# EAGLE design WS2811_Relais (EAGLE 9.5.2)
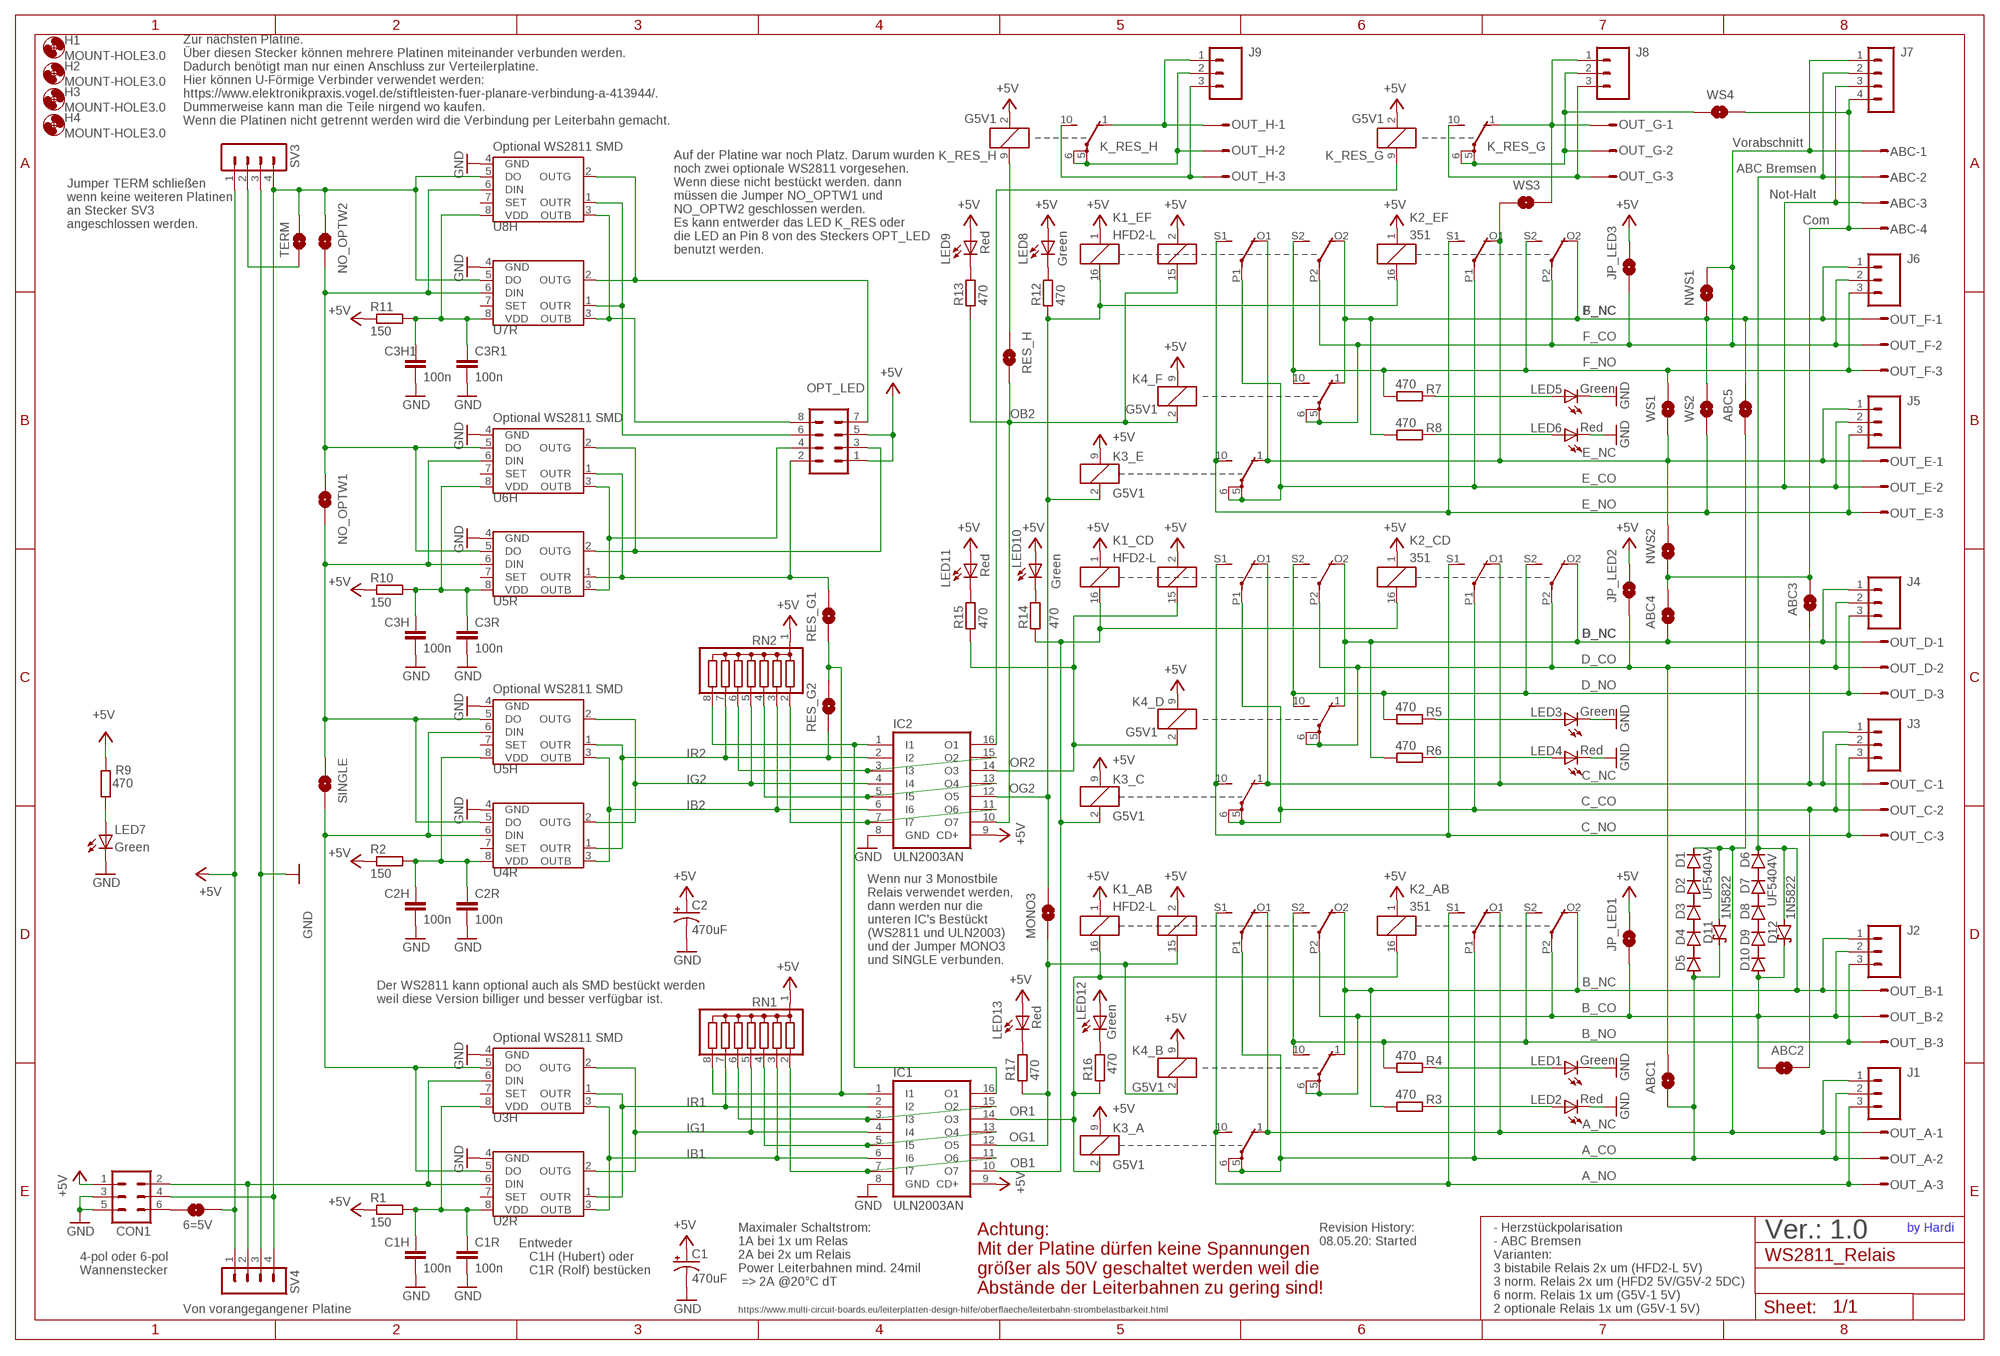
[diagram p0: schematic, sheet 1]

## Parts
6=5V  SOLDERJUMPERNO  [SJ_2S-NO]
ABC  STL1550-4ON_BOARD  [STL1550-4_ON_BOARD]
ABC1  SOLDERJUMPERNO  [SJ_2S-NO]
ABC2  SOLDERJUMPERNO  [SJ_2S-NO]
ABC3  SOLDERJUMPERNO  [SJ_2S-NO]
ABC4  SOLDERJUMPERNO  [SJ_2S-NO]
ABC5  SOLDERJUMPERNO  [SJ_2S-NO]
C1  470uF  SPARKFUN-CAPACITORS_100UF-25V-20%(PTH)  [SPARKFUN-CAPACITORS_CPOL-RADIAL-100UF-25V]
C1H  100n  C-EUC1206  [C1206]
C1R  100n  C-EU025-024X044  [C025-024X044]
C2  470uF  SPARKFUN-CAPACITORS_100UF-25V-20%(PTH)  [SPARKFUN-CAPACITORS_CPOL-RADIAL-100UF-25V]
C2H  100n  C-EUC1206  [C1206]
C2R  100n  C-EU025-024X044  [C025-024X044]
C3H  100n  C-EUC1206  [C1206]
C3H1  100n  C-EUC1206  [C1206]
C3R  100n  C-EU025-024X044  [C025-024X044]
C3R1  100n  C-EU025-024X044  [C025-024X044]
CON1  ML6  [ML6]
D1  UF5404V  [DO201-15-V]
D2  UF5404V  [DO201-15-V]
D3  UF5404V  [DO201-15-V]
D4  UF5404V  [DO201-15-V]
D5  UF5404V  [DO201-15-V]
D6  UF5404V  [DO201-15-V]
D7  UF5404V  [DO201-15-V]
D8  UF5404V  [DO201-15-V]
D9  UF5404V  [DO201-15-V]
D10  UF5404V  [DO201-15-V]
D11  1N5822  [DO41-7.6]
D12  1N5822  [DO41-7.6]
H1  MOUNT-HOLE3.0  [3,0]
H2  MOUNT-HOLE3.0  [3,0]
H3  MOUNT-HOLE3.0  [3,0]
H4  MOUNT-HOLE3.0  [3,0]
IC1  ULN2003AN  [DIL16]
IC2  ULN2003AN  [DIL16]
J1  M03PTH  [1X03]
J2  M03PTH  [1X03]
J3  M03PTH  [1X03]
J4  M03PTH  [1X03]
J5  M03PTH  [1X03]
J6  M03PTH  [1X03]
J7  MA04-1  [MA04-1]
J8  M03PTH  [1X03]
J9  M03PTH  [1X03]
JP_LED1  SOLDERJUMPERNO  [SJ_2S-NO]
JP_LED2  SOLDERJUMPERNO  [SJ_2S-NO]
JP_LED3  SOLDERJUMPERNO  [SJ_2S-NO]
K1_AB  HFD2-L  [HFD2-L]
K1_CD  HFD2-L  [HFD2-L]
K1_EF  HFD2-L  [HFD2-L]
K2_AB  351  [351]
K2_CD  351  [351]
K2_EF  351  [351]
K3_A  G5V1  [G5V1]
K3_C  G5V1  [G5V1]
K3_E  G5V1  [G5V1]
K4_B  G5V1  [G5V1]
K4_D  G5V1  [G5V1]
K4_F  G5V1  [G5V1]
K_RES_G  G5V1  [G5V1]
K_RES_H  G5V1  [G5V1]
LED1  Green  LED3MM  [LED3MM]
LED2  Red  LED3MM  [LED3MM]
LED3  Green  LED3MM  [LED3MM]
LED4  Red  LED3MM  [LED3MM]
LED5  Green  LED3MM  [LED3MM]
LED6  Red  LED3MM  [LED3MM]
LED7  Green  LED3MM  [LED3MM]
LED8  Green  LED3MM  [LED3MM]
LED9  Red  LED3MM  [LED3MM]
LED10  Green  LED3MM  [LED3MM]
LED11  Red  LED3MM  [LED3MM]
LED12  Green  LED3MM  [LED3MM]
LED13  Red  LED3MM  [LED3MM]
MONO3  SOLDERJUMPERNO  [SJ_2S-NO]
NO_OPTW1  SOLDERJUMPERNO  [SJ_2S-NO]
NO_OPTW2  SOLDERJUMPERNO  [SJ_2S-NO]
NWS1  SOLDERJUMPERNO  [SJ_2S-NO]
NWS2  SOLDERJUMPERNO  [SJ_2S-NO]
OPT_LED  CON-HARTING-ML_ML08  [CON-HARTING-ML_ML08]
OUT_A  STL1550-3  [STL1550-3_ON_BOARD]
OUT_B  STL1550-3  [STL1550-3_ON_BOARD]
OUT_C  STL1550-3  [STL1550-3_ON_BOARD]
OUT_D  STL1550-3  [STL1550-3_ON_BOARD]
OUT_E  STL1550-3  [STL1550-3_ON_BOARD]
OUT_F  STL1550-3  [STL1550-3_ON_BOARD]
OUT_G  STL1550-3  [STL1550-3_ON_BOARD]
OUT_H  STL1550-3  [STL1550-3_ON_BOARD]
R1  150  RCL_R-EU_0207/2V  [RCL_0207/2V]
R2  150  RCL_R-EU_0207/2V  [RCL_0207/2V]
R3  470  R0204/2V  [0204/2V]
R4  470  R0204/2V  [0204/2V]
R5  470  R0204/2V  [0204/2V]
R6  470  R0204/2V  [0204/2V]
R7  470  R0204/2V  [0204/2V]
R8  470  R0204/2V  [0204/2V]
R9  470  R0204/2V  [0204/2V]
R10  150  RCL_R-EU_0207/2V  [RCL_0207/2V]
R11  150  RCL_R-EU_0207/2V  [RCL_0207/2V]
R12  470  R0204/2V  [0204/2V]
R13  470  R0204/2V  [0204/2V]
R14  470  R0204/2V  [0204/2V]
R15  470  R0204/2V  [0204/2V]
R16  470  R0204/2V  [0204/2V]
R17  470  R0204/2V  [0204/2V]
RES_G1  SOLDERJUMPERNO  [SJ_2S-NO]
RES_G2  SOLDERJUMPERNO  [SJ_2S-NO]
RES_H  SOLDERJUMPERNO  [SJ_2S-NO]
RN1  G07R  [SIL8]
RN2  G07R  [SIL8]
SINGLE  SOLDERJUMPERNO  [SJ_2S-NO]
SV3  MA04-1  [MA04-1]
SV4  MA04-1  [MA04-1]
TERM  SOLDERJUMPERNO  [SJ_2S-NO]
U2R  WS2811  S3PO_MODUL_WS2811_SOUND_MP3-TF-16P_WS2811_AND_ATTINY_WS2811-ICTINY45-20-DIP  [S3PO_MODUL_WS2811_SOUND_MP3-TF-16P_WS2811_AND_ATTINY_WS2811_DIP08]
U3H  WS2811 SOT-8  S3PO_MODUL_WS2811_SOUND_MP3-TF-16P_WS2811_AND_ATTINY_WS2811-ICSOP8  [SOP8]
U4R  WS2811  S3PO_MODUL_WS2811_SOUND_MP3-TF-16P_WS2811_AND_ATTINY_WS2811-ICTINY45-20-DIP  [S3PO_MODUL_WS2811_SOUND_MP3-TF-16P_WS2811_AND_ATTINY_WS2811_DIP08]
U5H  WS2811 SOT-8  S3PO_MODUL_WS2811_SOUND_MP3-TF-16P_WS2811_AND_ATTINY_WS2811-ICSOP8  [SOP8]
U5R  WS2811  S3PO_MODUL_WS2811_SOUND_MP3-TF-16P_WS2811_AND_ATTINY_WS2811-ICTINY45-20-DIP  [S3PO_MODUL_WS2811_SOUND_MP3-TF-16P_WS2811_AND_ATTINY_WS2811_DIP08]
U6H  WS2811 SOT-8  S3PO_MODUL_WS2811_SOUND_MP3-TF-16P_WS2811_AND_ATTINY_WS2811-ICSOP8  [SOP8]
U7R  WS2811  S3PO_MODUL_WS2811_SOUND_MP3-TF-16P_WS2811_AND_ATTINY_WS2811-ICTINY45-20-DIP  [S3PO_MODUL_WS2811_SOUND_MP3-TF-16P_WS2811_AND_ATTINY_WS2811_DIP08]
U8H  WS2811 SOT-8  S3PO_MODUL_WS2811_SOUND_MP3-TF-16P_WS2811_AND_ATTINY_WS2811-ICSOP8  [SOP8]
WS1  SOLDERJUMPERNO  [SJ_2S-NO]
WS2  SOLDERJUMPERNO  [SJ_2S-NO]
WS3  SOLDERJUMPERNO  [SJ_2S-NO]
WS4  SOLDERJUMPERNO  [SJ_2S-NO]

## Nets
$N100: IC2.7(I7) IC2.11(O6) RN2.2
+5V: 6=5V.2 C1.1(+) C2.1(+) CON1.1 IC1.9(CD+) IC2.9(CD+) JP_LED1.2 JP_LED2.2 JP_LED3.2 K1_AB.1 K1_AB.2 K1_CD.1 K1_CD.2 K1_EF.1 K1_EF.2 K2_AB.1 K2_CD.1 K2_EF.1 K3_A.9 K3_C.9 K3_E.9 K4_B.9 K4_D.9 K4_F.9 K_RES_G.2 K_RES_H.2 LED8.A LED9.A LED10.A LED11.A LED12.A LED13.A OPT_LED.1 OPT_LED.5 R1.1 R2.1 R9.1 R10.1 R11.1 RN1.1 RN2.1 SV3.1 SV4.1
A_CO: ABC1.1 D5.A D11.C J1.2 K1_AB.P1(2:P) K2_AB.P1(2:P) K3_A.5(2:P) K3_A.6(2:P) OUT_A.2
A_NC: ABC5.2 D1.C D11.A J1.1 K1_AB.O1(2:O) K2_AB.O1(2:O) K3_A.1(2:O) OUT_A.1
A_NO: J1.3 K1_AB.S1(2:S) K2_AB.S1(2:S) K3_A.10(2:S) OUT_A.3
B_CO: ABC2.1 D10.A D12.C J2.2 JP_LED1.1 K1_AB.P2(3:P) K2_AB.P2(3:P) K4_B.5(2:P) K4_B.6(2:P) OUT_B.2
B_NC: ABC.2 D6.C D12.A J2.1 J7.2 K1_AB.O2(3:O) K2_AB.O2(3:O) K4_B.1(2:O) OUT_B.1 R3.2
B_NO: J2.3 K1_AB.S2(3:S) K2_AB.S2(3:S) K4_B.10(2:S) OUT_B.3 R4.2
C_CO: ABC2.2 J3.2 K1_CD.P1(2:P) K2_CD.P1(2:P) K3_C.5(2:P) K3_C.6(2:P) OUT_C.2
C_NC: ABC3.2 J3.1 K1_CD.O1(2:O) K2_CD.O1(2:O) K3_C.1(2:O) OUT_C.1
C_NO: J3.3 K1_CD.S1(2:S) K2_CD.S1(2:S) K3_C.10(2:S) OUT_C.3
D_CO: ABC1.2 J4.2 JP_LED2.1 K1_CD.P2(3:P) K2_CD.P2(3:P) K4_D.5(2:P) K4_D.6(2:P) OUT_D.2
D_NC: ABC4.2 J4.1 K1_CD.O2(3:O) K2_CD.O2(3:O) K4_D.1(2:O) OUT_D.1 R6.2
D_NO: J4.3 K1_CD.S2(3:S) K2_CD.S2(3:S) K4_D.10(2:S) OUT_D.3 R5.2
E_CO: ABC.3 J5.2 J7.3 K1_EF.P1(2:P) K2_EF.P1(2:P) K3_E.5(2:P) K3_E.6(2:P) OUT_E.2
E_NC: J5.1 K1_EF.O1(2:O) K2_EF.O1(2:O) K3_E.1(2:O) NWS2.1 OUT_E.1 WS1.2 WS3.2
E_NO: J5.3 K1_EF.S1(2:S) K2_EF.S1(2:S) K3_E.10(2:S) OUT_E.3 WS2.2
F_CO: ABC.1 J6.2 J7.1 JP_LED3.1 K1_EF.P2(3:P) K2_EF.P2(3:P) K4_F.5(2:P) K4_F.6(2:P) NWS1.1 OUT_F.2
F_NC: ABC5.1 J6.1 K1_EF.O2(3:O) K2_EF.O2(3:O) K4_F.1(2:O) NWS1.2 OUT_F.1 R8.2 WS2.1
F_NO: J6.3 K1_EF.S2(3:S) K2_EF.S2(3:S) K4_F.10(2:S) OUT_F.3 R7.2 WS1.1
GND: C1.2(-) C1H.2 C1R.2 C2.2(-) C2H.2 C2R.2 C3H1.2 C3H.2 C3R1.2 C3R.2 CON1.3 CON1.5 IC1.8(GND) IC2.8(GND) LED1.K(C) LED2.K(C) LED3.K(C) LED4.K(C) LED5.K(C) LED6.K(C) LED7.K(C) SV3.3 SV4.3 U2R.4(GND) U3H.4(GND) U4R.4(GND) U5H.4(GND) U5R.4(GND) U6H.4(GND) U7R.4(GND) U8H.4(GND)
IB1: IC1.6(I6) RN1.3 U2R.3(OUTB) U3H.3(OUTB)
IB2: IC2.6(I6) RN2.3 U4R.3(OUTB) U5H.3(OUTB)
IB3: OPT_LED.4 U5R.3(OUTB) U6H.3(OUTB)
IB4: OPT_LED.8 U7R.3(OUTB) U8H.3(OUTB)
IG1: IC1.4(I4) RN1.5 U2R.2(OUTG) U3H.2(OUTG)
IG2: IC2.4(I4) RN2.5 U4R.2(OUTG) U5H.2(OUTG)
IG3: OPT_LED.3 U5R.2(OUTG) U6H.2(OUTG)
IG4: OPT_LED.7 U7R.2(OUTG) U8H.2(OUTG)
IR1: IC1.2(I2) RN1.7 U2R.1(OUTR) U3H.1(OUTR)
IR2: IC2.2(I2) RES_G2.2 RN2.7 U4R.1(OUTR) U5H.1(OUTR)
IR3: IC1.1(I1) RES_G1.2 RES_G2.1 RN1.8
IR4: OPT_LED.6 U7R.1(OUTR) U8H.1(OUTR)
N$1: CON1.2 SV4.2 U2R.6(DIN) U3H.6(DIN)
N$2: LED2.A R3.1
N$3: CON1.4 NO_OPTW2.1 SV3.4 SV4.4 TERM.1 U7R.5(DO) U8H.5(DO)
N$4: C1H.1 C1R.1 R1.2 U2R.8(VDD) U3H.8(VDD)
N$5: LED1.A R4.1
N$6: 6=5V.1 CON1.6
N$7: IC1.7(I7) IC1.11(O6) RN1.2
N$8: LED4.A R6.1
N$9: IC1.3(I3) IC1.15(O2) RN1.6
N$10: SV3.2 TERM.2
N$11: IC1.5(I5) IC1.13(O4) RN1.4
N$12: LED3.A R5.1
N$13: C2H.1 C2R.1 R2.2 U4R.8(VDD) U5H.8(VDD)
N$14: LED6.A R8.1
N$15: LED5.A R7.1
N$16: D1.A D2.C
N$17: IC1.16(O1) IC2.1(I1) RN2.8
N$18: IC2.5(I5) IC2.13(O4) RN2.4
N$19: D2.A D3.C
N$20: SINGLE.2 U2R.5(DO) U3H.5(DO) U4R.6(DIN) U5H.6(DIN)
N$21: D3.A D4.C
N$22: LED7.A R9.2
N$23: D4.A D5.C
N$24: D7.A D8.C
N$25: D8.A D9.C
N$26: D9.A D10.C
N$27: D6.A D7.C
N$28: OPT_LED.2 RES_G1.1 U5R.1(OUTR) U6H.1(OUTR)
N$29: IC2.3(I3) IC2.15(O2) RN2.6
N$30: J8.2 K_RES_G.5(2:P) K_RES_G.6(2:P) OUT_G.2 WS4.2
N$31: IC2.16(O1) K_RES_G.9
N$32: J8.1 K_RES_G.1(2:O) OUT_G.1 WS3.1
N$33: J8.3 K_RES_G.10(2:S) OUT_G.3
N$34: NO_OPTW1.1 NO_OPTW2.2 U5R.5(DO) U6H.5(DO) U7R.6(DIN) U8H.6(DIN)
N$35: C3H.1 C3R.1 R10.2 U5R.8(VDD) U6H.8(VDD)
N$36: J9.2 K_RES_H.5(2:P) K_RES_H.6(2:P) OUT_H.2
N$37: NO_OPTW1.2 SINGLE.1 U4R.5(DO) U5H.5(DO) U5R.6(DIN) U6H.6(DIN)
N$38: J9.3 K_RES_H.10(2:S) OUT_H.3
N$39: C3H1.1 C3R1.1 R11.2 U7R.8(VDD) U8H.8(VDD)
N$40: J9.1 K_RES_H.1(2:O) OUT_H.1
N$41: K_RES_H.9 RES_H.2
N$42: LED8.K(C) R12.1
N$43: LED9.K(C) R13.1
N$44: LED10.K(C) R14.1
N$45: LED11.K(C) R15.1
N$46: LED12.K(C) R16.1
N$47: LED13.K(C) R17.1
N$49: ABC3.1 ABC4.1 ABC.4 J7.4 NWS2.2 WS4.1
OB1: IC1.10(O7) K1_CD.16 K2_CD.16 K3_C.2 R14.2
OB2: IC2.10(O7) K1_EF.15 K4_F.2 R13.2 RES_H.1
OG1: IC1.12(O5) K1_AB.15 K4_B.2 MONO3.2 R17.2
OG2: IC2.12(O5) K1_EF.16 K2_EF.16 K3_E.2 MONO3.1 R12.2
OR1: IC1.14(O3) K1_AB.16 K2_AB.16 K3_A.2 R16.2
OR2: IC2.14(O3) K1_CD.15 K4_D.2 R15.2
Unconnected: U2R.7(SET) U3H.7(SET) U4R.7(SET) U5H.7(SET) U5R.7(SET) U6H.7(SET) U7R.7(SET) U8H.7(SET)

## Notes on the sheet
- Zur nächsten Platine. 
  Über diesen Stecker können mehrere Platinen miteinander verbunden werden.
  Dadurch benötigt man nur einen Anschluss zur Verteilerplatine.
  Hier können U-Förmige Verbinder verwendet werden: 
  https://www.elektronikpraxis.vogel.de/stiftleisten-fuer-planare-verbindung-a-413944/.
  Dummerweise kann man die Teile nirgend wo kaufen.
  Wenn die Platinen nicht getrennt werden wird die Verbindung per Leiterbahn gemacht.
- Vorabschnitt
- Optional WS2811 SMD
- ABC Bremsen
- Not-Halt
- Com
- Jumper TERM schließen 
  wenn keine weiteren Platinen
  an Stecker SV3 
  angeschlossen werden.
- Auf der Platine war noch Platz. Darum wurden
  noch zwei optionale WS2811 vorgesehen.
  Wenn diese nicht bestückt werden. dann
  müssen die Jumper NO_OPTW1 und
  NO_OPTW2 geschlossen werden.
  Es kann entwerder das LED K_RES oder
  die LED an Pin 8 von des Steckers OPT_LED
  benutzt werden.
- Optional WS2811 SMD
- Optional WS2811 SMD
- Wenn nur 3 Monostbile
  Relais verwendet werden,
  dann werden nur die
  unteren IC's Bestückt
  (WS2811 und ULN2003)
  und der Jumper MONO3
  und SINGLE verbunden.
- Der WS2811 kann optional auch als SMD bestückt werden
  weil diese Version billiger und besser verfügbar ist.
- Optional WS2811 SMD
- Ver.: 1.0
- Maximaler Schaltstrom:
  1A bei 1x um Relas
  2A bei 2x um Relais
  Power Leiterbahnen mind. 24mil
   => 2A @20°C dT
- Achtung:
  Mit der Platine dürfen keine Spannungen
  größer als 50V geschaltet werden weil die
  Abstände der Leiterbahnen zu gering sind!
- Revision History:
  08.05.20: Started
- - Herzstückpolarisation
  - ABC Bremsen
  Varianten:
  3 bistabile Relais 2x um (HFD2-L 5V)
  3 norm. Relais 2x um (HFD2 5V/G5V-2 5DC)
  6 norm. Relais 1x um (G5V-1 5V)
  2 optionale Relais 1x um (G5V-1 5V)
- by Hardi
- 4-pol oder 6-pol 
  Wannenstecker
- Entweder 
     C1H (Hubert) oder 
     C1R (Rolf) bestücken
- https://www.multi-circuit-boards.eu/leiterplatten-design-hilfe/oberflaeche/leiterbahn-strombelastbarkeit.html
- Von vorangegangener Platine

## Library data of the parts
6=5V ABC1-ABC5 JP_LED1-JP_LED3 MONO3 NO_OPTW1 NO_OPTW2 NWS1 NWS2 RES_G1 RES_G2 RES_H SINGLE TERM WS1-WS4 = SparkFun-Retired:SOLDERJUMPER: Solder Jumper Standard SMD solder jumper. Used to automate production. Two varients : Normally Open and Normally Closed are the same, but have different paste layers. NC will have a large amount of paste and should jumper during reflow.
ABC = SchraubStecker3.5:STL1550-4: CONNECTOR Rastermass 3.5 mm Kabel: AK(Z)1550 Platine: STL(Z)1550 Ali: KF2EDG-3.5
C1 C2 = Sound_MP3-TF-16P_and_WS2811:SPARKFUN-CAPACITORS_100UF-25V-20%(PTH): CAP-08439; PROD_ID: CAP-08439
C1H C1R C2H C2R C3H C3H1 C3R C3R1 = rcl:C-EU: CAPACITOR, European symbol; SPICEPREFIX: C
CON1 = con-harting-ml:ML6: HARTING; OC_FARNELL: unknown; OC_NEWARK: unknown
D1-D10 = diode:UF5404: DIODE standard rectifier, 3 A, 50 V (Motorola)
D11 D12 = diode:1N5822: 1.0A SCHOTTKY BARRIER RECTIFIER Source: http://www.diodes.com/datasheets/ds23001.pdf
H1-H4 = holes:MOUNT-HOLE: MOUNTING HOLE with drill center marker
IC1 IC2 = uln-udn:ULN2003A: DRIVER ARRAY; REICHELT: ULN 2003A STM; REICHELT_EU: 0,22 €; REICHELT_LNK: https://www.reichelt.de/seven-darlington-arrays-dip-16-uln-2003a-stm-p216685.html?&trstct=pos_0
J1-J6 J8 J9 = SparkFun-Connectors:M03: Header 3 Standard 3-pin 0.1" header. Use with straight break away headers (SKU : PRT-00116), right angle break away headers (PRT-00553), swiss pins (PRT-00743), machine pins (PRT-00117), and female headers (PRT-00115). Molex polarized connector foot print use with SKU : PRT-08232 with associated crimp pins and housings.
J7 SV3 SV4 = con-lstb:MA04-1: PIN HEADER
K1_AB K1_CD K1_EF = WS2811_Relais:HFD2-L: RELAY 2 x switch, HFD2-L by Hardi; OC_FARNELL: unknown; OC_NEWARK: unknown
K2_AB K2_CD K2_EF = relay:351: RELAY 2 x switch, Omron; OC_FARNELL: unknown; OC_NEWARK: unknown
K3_A K3_C K3_E K4_B K4_D K4_F K_RES_G K_RES_H = relay:G5V1: RELAY 1 x switch, 0.5 A/125 V AC, 1 A/24 V DC , Omron; MPN: G5V-1-DC24; OC_FARNELL: 9949593; OC_NEWARK: 36M6377
LED1-LED13 = Arduino_fuer_LEDs_DCC_2:LED: LED OSRAM: - CHIPLED LG R971, LG N971, LY N971, LG Q971, LY Q971, LO R971, LY R971 LH N974, LH R974 LS Q976, LO Q976, LY Q976 LO Q996 - Hyper CHIPLED LW Q18S LB Q993, LB Q99A, LB R99A - SideLED LS A670, LO A670, LY A670, LG A670, LP A670 LB A673, LV A673, LT A673, LW A673 LH A674 LY A675 LS A676, LA A676, LO A676, LY A676, LW A676 LS A679, LY A679, LG A679 - Hyper Micro SIDELED® LS Y876, LA Y876, LO Y876, LY Y876 LT Y87S - SmartLED LW L88C, LW L88S LB L89C, LB L89S, LG L890 LS L89K, LO L89K, LY L89K LS L896, LA L896, LO L896, LY L896 - TOPLED LS T670, LO T670, LY T670, LG T670, LP T670 LSG T670, LSP T670, LSY T670, LOP T670, LYG T670 LG T671, LOG T671, LSG T671 LB T673, LV T673, LT T673, LW T673 LH T674 LS T676, LA T676, LO T676, LY T676, LB T676, LH T676, LSB T676, LW T676 LB T67C, LV T67C, LT T67C, LS T67K, LO T67K, LY T67K, LW E67C LS E67B, LA E67B, LO E67B, LY E67B, LB E67C, LV E67C, LT E67C LW T67C LS T679, LY T679, LG T679 LS T770, LO T770, LY T770, LG T770, LP T770 LB T773, LV T773, LT T773, LW T773 LH T774 LS E675, LA E675, LY E675, LS T675 LS T776, LA T776, LO T776, LY T776, LB T776 LHGB T686 LT T68C, LB T68C - Hyper Mini TOPLED® LB M676 - Mini TOPLED Santana® LG M470 LS M47K, LO M47K, LY M47K Source: http://www.osram.convergy.de LUXEON: - LUMILED® LXK2-PW12-R00, LXK2-PW12-S00, LXK2-PW14-U00, LXK2-PW14-V00 LXK2-PM12-R00, LXK2-PM12-S00, LXK2-PM14-U00 LXK2-PE12-Q00, LXK2-PE12-R00, LXK2-PE12-S00, LXK2-PE14-T00, LXK2-PE14-U00 LXK2-PB12-K00, LXK2-PB12-L00, LXK2-PB12-M00, LXK2-PB14-N00, LXK2-PB14-P00, LXK2-PB14-Q00 LXK2-PR12-L00, LXK2-PR12-M00, LXK2-PR14-Q00, LXK2-PR14-R00 LXK2-PD12-Q00, LXK2-PD12-R00, LXK2-PD12-S00 LXK2-PH12-R00, LXK2-PH12-S00 LXK2-PL12-P00, LXK2-PL12-Q00, LXK2-PL12-R00 Source: www.luxeon.com KINGBRIGHT: KA-3528ASYC Source: www.kingbright.com
OPT_LED = PushButtonAction_4017_2:CON-HARTING-ML_ML08: Modified by Hardi; OC_FARNELL: unknown; OC_NEWARK: unknown
OUT_A OUT_B OUT_C OUT_D OUT_E OUT_F OUT_G OUT_H = SchraubStecker3.5:STL1550-3: CONNECTOR Rastermass 3.5 mm Kabel: AK(Z)1550 Platine: STL(Z)1550 Ali: KF2EDG-3.5
R1 R2 R10 R11 = Sound_MP3-TF-16P_and_WS2811:RCL_R-EU_: RESISTOR, European symbol; SPICEPREFIX: R
R3-R9 R12-R17 = Arduino_fuer_LEDs_DCC_2:R: RESISTOR, European symbol
RN1 RN2 = resistor-sil:G07R: SIL RESISTOR; OC_FARNELL: unknown; OC_NEWARK: unknown
U2R U4R U5R U7R = S3PO_Modul_WS2811:S3PO_MODUL_WS2811_SOUND_MP3-TF-16P_WS2811_AND_ATTINY_WS2811-IC: Die Pin nummern im Dokument https://cdn-shop.adafruit.com/datasheets/WS2811.pdf für R und G sind vertauscht ;-(; PROD_ID: IC-09439; VALUE: TINY45-20-DIP
U3H U5H U6H U8H = S3PO_Modul_WS2811:S3PO_MODUL_WS2811_SOUND_MP3-TF-16P_WS2811_AND_ATTINY_WS2811-IC: Die Pin nummern im Dokument https://cdn-shop.adafruit.com/datasheets/WS2811.pdf für R und G sind vertauscht ;-(

## Board
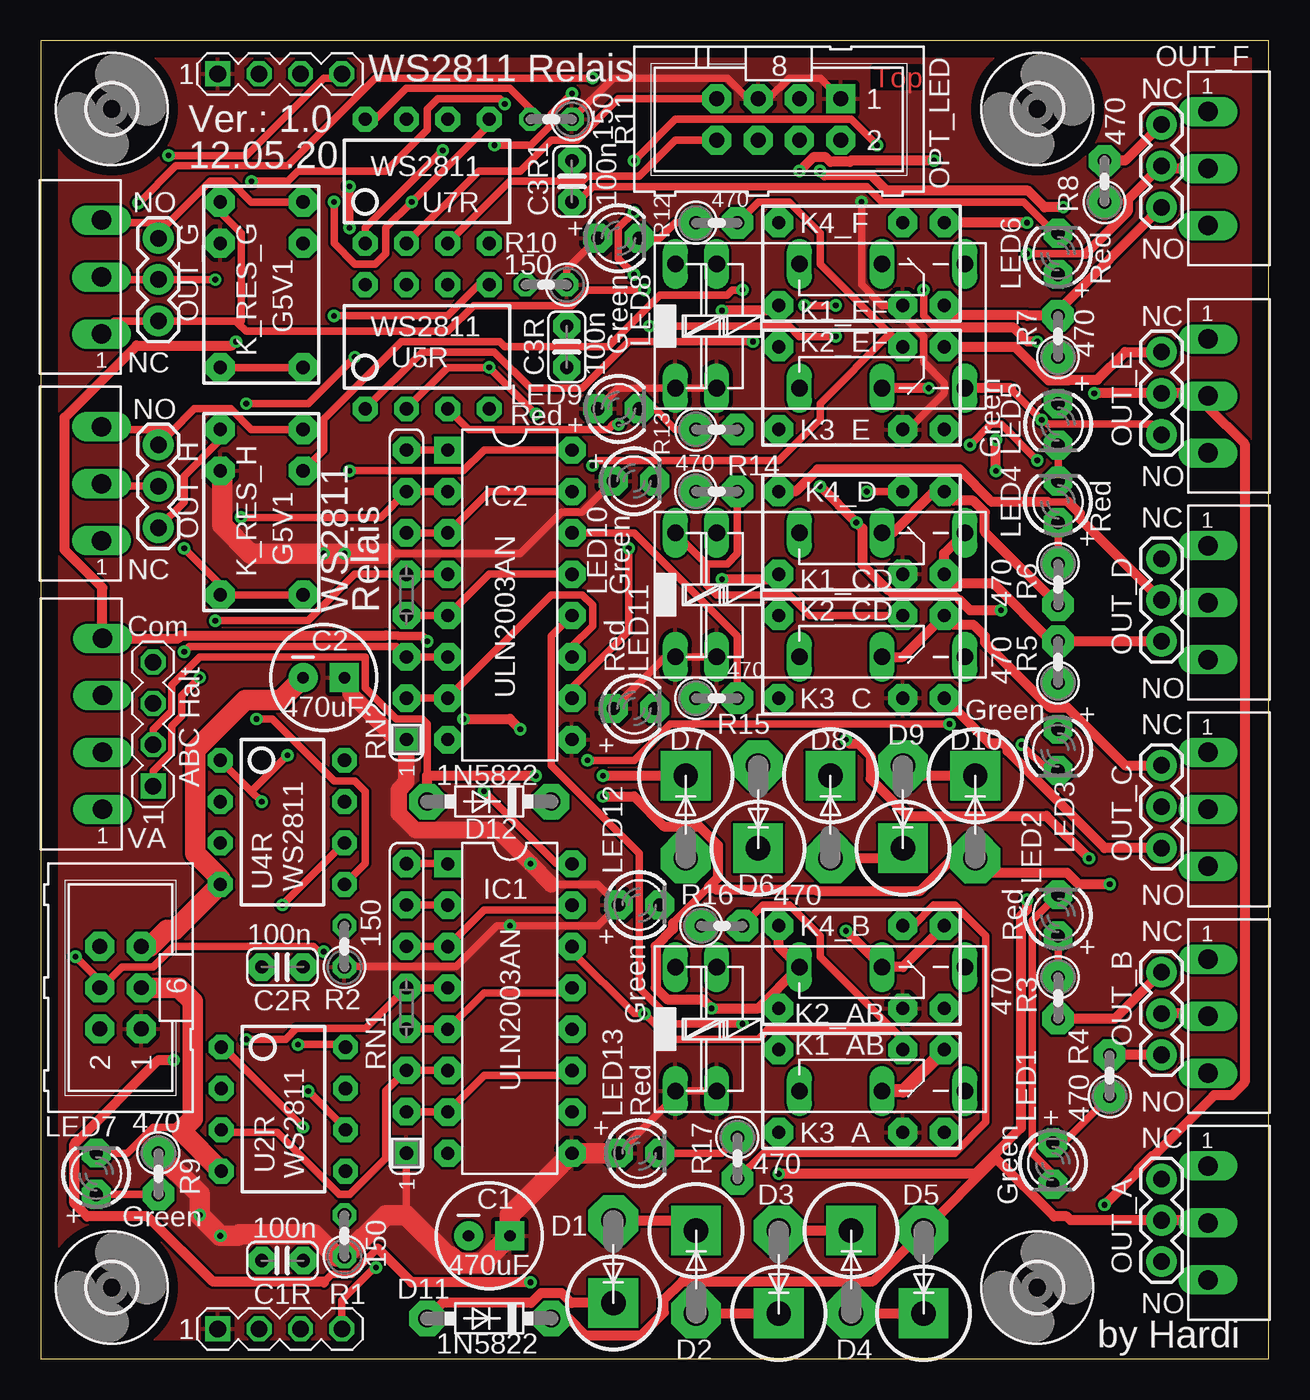
[diagram p1: board, top side]
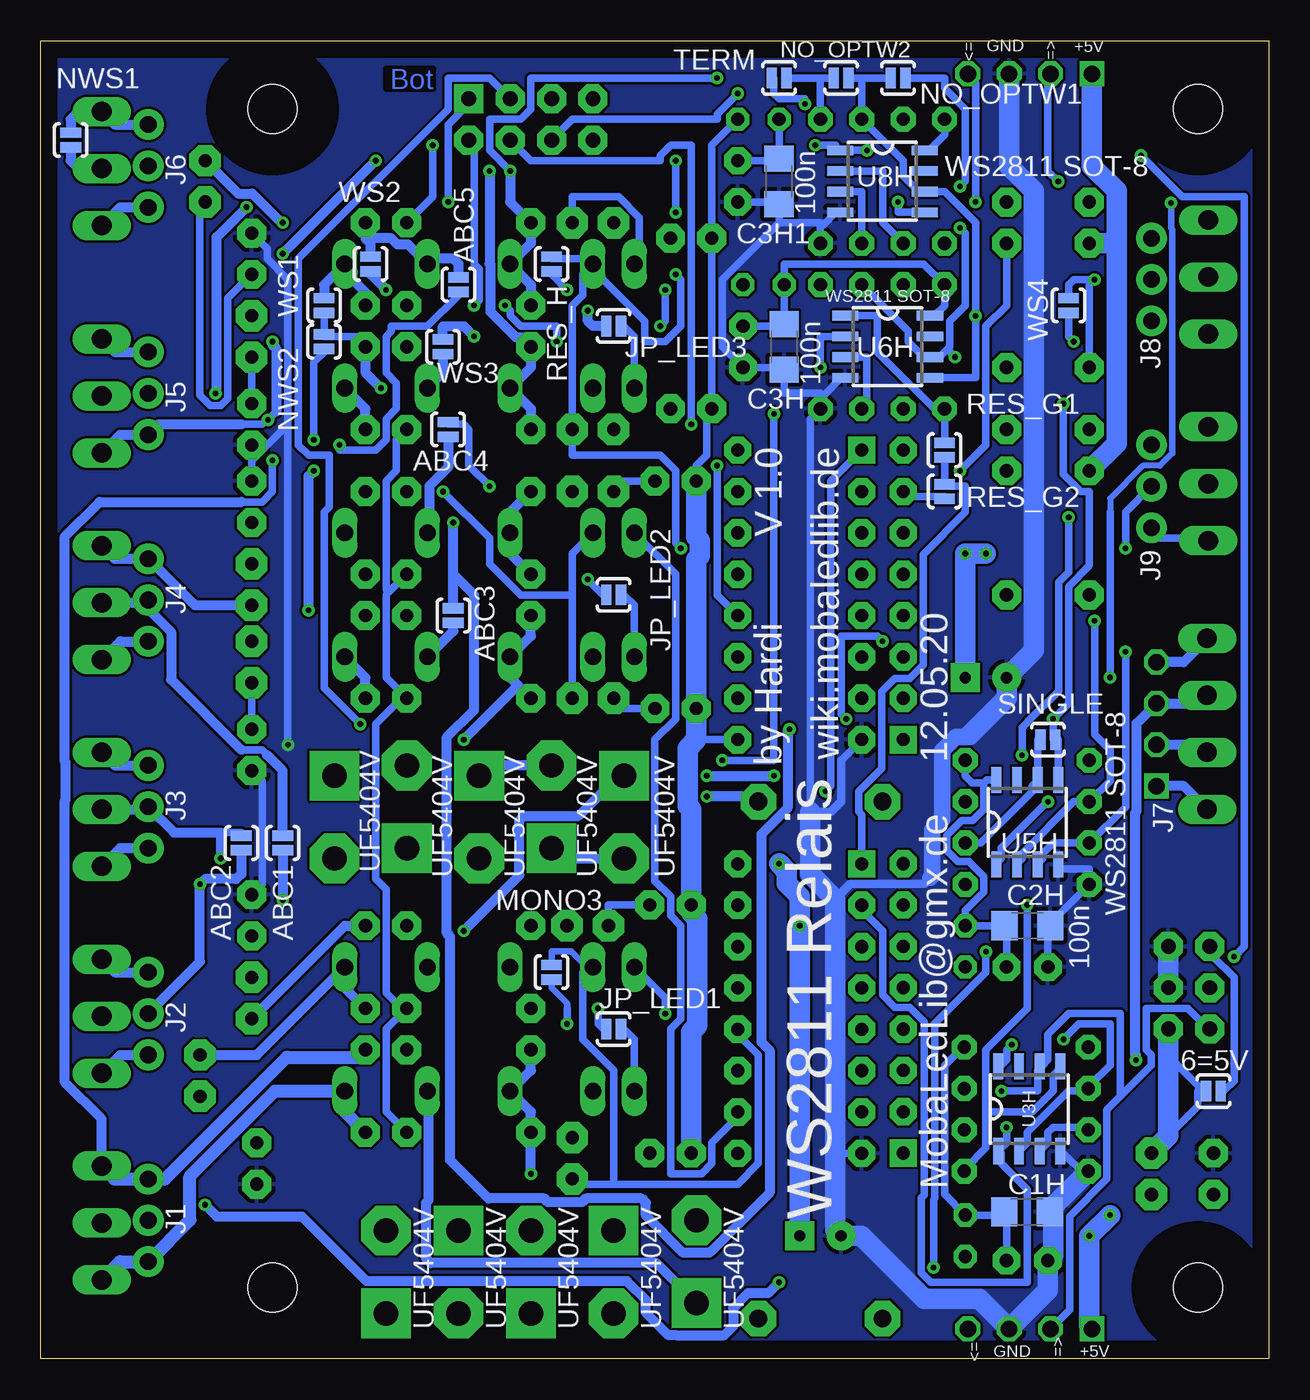
[diagram p2: board, bottom side, seen from below]

Size 75.42 x 80.97 mm. Coordinates in mm from the lower left corner, seen from the top.
Outline: 0,0 75.42,0 75.42,80.97 0,80.97 0,0
Copper layers (1*16): Top 0.035mm / dielectric 1.5mm / Bottom 0.035mm
Design rules "default *": minimum track width 6mil, minimum drill 0.35mm, track to track 6mil, track to pad 6mil, pad to pad 6mil, via to via 6mil, smd to smd 6mil, copper to edge 40mil, drill to drill 6mil, minimum pad ring 10mil, minimum via ring 8mil, stop-mask expansion 4mil, vias tented up to drill 0mil, thermal gap 10mil

### Footprints (pad centres in the part's own frame; a part is rotated, then mirrored left to right if it is on the bottom)
SJ_2S-NO = smd 0.635 x 1.27: 1 -0.45,0; 2 0.45,0
STL1550-4_ON_BOARD = drill 1.2 long: 1 -1.75,0; 2 1.75,0; 3 5.25,0; 4 8.75,0
SPARKFUN-CAPACITORS_CPOL-RADIAL-100UF-25V = drill 0.7 pad 1.778 square: 1 1.27,0 | drill 0.7 pad 1.778: 2 -1.27,0
C1206 = smd 1.6 x 1.8: 1 -1.4,0; 2 1.4,0
C025-024X044 = drill 0.813 pad 1.676 octagon: 1 -1.27,0; 2 1.27,0
ML6 = drill 0.914 pad 1.778 octagon: 1 -2.54,-1.27; 2 -2.54,1.27; 3 0,-1.27; 4 0,1.27; 5 2.54,-1.27; 6 2.54,1.27
DO201-15-V = drill 1.499 pad 3.048 octagon: A 5.08,0 | drill 1.499 pad 3.048 square: C 0,0
DO41-7.6 = drill 1.1 pad 2.184 octagon: A 3.81,0; C -3.81,0
3,0 = hole 3: 0,0
DIL16 = drill 0.813 pad 1.676 square: 1 -8.89,-3.81 | drill 0.813 pad 1.676 octagon: 2 -6.35,-3.81; 3 -3.81,-3.81; 4 -1.27,-3.81; 5 1.27,-3.81; 6 3.81,-3.81; 7 6.35,-3.81; 8 8.89,-3.81; 9 8.89,3.81; 10 6.35,3.81; 11 3.81,3.81; 12 1.27,3.81; 13 -1.27,3.81; 14 -3.81,3.81; 15 -6.35,3.81; 16 -8.89,3.81
1X03 = drill 1.016 pad 1.88: 1 0,0; 2 2.54,0; 3 5.08,0
MA04-1 = drill 1.016 pad 1.524 square: 1 -3.81,0 | drill 1.016 pad 1.524 octagon: 2 -1.27,0; 3 1.27,0; 4 3.81,0
HFD2-L = drill 1.016 long: 1 -3.81,-3.81; 2 -1.27,-3.81; 15 -1.27,3.81; 16 -3.81,3.81; O1 8.89,-3.81; O2 8.89,3.81; P1 3.81,-3.81; P2 3.81,3.81; S1 13.97,-3.81; S2 13.97,3.81
351 = drill 1.016 long: 1 -3.81,-3.81; 16 -3.81,3.81; O1 8.89,-3.81; O2 8.89,3.81; P1 3.81,-3.81; P2 3.81,3.81; S1 13.97,-3.81; S2 13.97,3.81
G5V1 = drill 0.813 pad 1.778 octagon: 1 -5.08,-2.54; 2 -2.54,-2.54; 5 5.08,-2.54; 6 5.08,2.54; 9 -2.54,2.54; 10 -5.08,2.54
LED3MM = drill 0.813 pad 1.778 octagon: A -1.27,0; K 1.27,0
CON-HARTING-ML_ML08 = drill 0.914 pad 1.778 square: 1 -5.08,-1.27 | drill 0.914 pad 1.778 octagon: 2 -5.08,1.27; 3 -2.54,-1.27; 4 -2.54,1.27; 5 0,-1.27; 6 0,1.27; 7 2.54,-1.27; 8 2.54,1.27
STL1550-3_ON_BOARD = drill 1.2 long: 1 -1.75,0; 2 1.75,0; 3 5.25,0
RCL_0207/2V = drill 0.813 pad 1.422 octagon: 1 -1.27,0; 2 1.27,0
0204/2V = drill 0.813 pad 1.93 octagon: 1 -1.27,0; 2 1.27,0
SIL8 = drill 0.813 pad 1.676 square: 1 -8.89,0 | drill 0.813 pad 1.676 octagon: 2 -6.35,0; 3 -3.81,0; 4 -1.27,0; 5 1.27,0; 6 3.81,0; 7 6.35,0; 8 8.89,0
S3PO_MODUL_WS2811_SOUND_MP3-TF-16P_WS2811_AND_ATTINY_WS2811_DIP08 = drill 0.813 pad 1.524 octagon: 1 -3.81,-3.81; 2 -1.27,-3.81; 3 1.27,-3.81; 4 3.81,-3.81; 5 3.81,3.81; 6 1.27,3.81; 7 -1.27,3.81; 8 -3.81,3.81
SOP8 = smd 0.6 x 1.6: 1 -1.905,-2.6; 2 -0.635,-2.6; 3 0.635,-2.6; 4 1.905,-2.6; 5 1.905,2.6; 6 0.635,2.6; 7 -0.635,2.6; 8 -1.905,2.6

### Placement (x,y rotation side)
6=5V  3.41,16.45 180 bottom
ABC  3.79,35.5 90 top
ABC1  60.56,31.68 90 bottom
ABC2  63.1,31.68 90 bottom
ABC3  50.08,45.66 270 bottom
ABC4  50.4,57.09 270 bottom
ABC5  49.77,65.98 270 bottom
C1  27.54,7.55 0 top
C1H  14.85,9.03 0 bottom
C1R  14.85,6.03 180 top
C2  17.38,41.84 0 top
C2H  14.84,26.61 0 bottom
C2R  14.84,24.06 180 top
C3H  29.76,62.16 270 bottom
C3H1  30.08,72.33 270 bottom
C3R  32.3,62.16 270 top
C3R1  32.62,72.33 270 top
CON1  4.9,22.79 90 top
D1  35.16,3.43 90 top
D2  40.24,7.87 270 top
D3  45.32,2.79 90 top
D4  49.77,7.87 270 top
D5  54.21,2.79 90 top
D6  39.61,35.81 270 top
D7  44.05,31.37 90 top
D8  48.5,35.81 270 top
D9  52.94,31.37 90 top
D10  57.38,35.81 270 top
D11  27.54,2.48 180 top
D12  27.54,34.23 180 top
H1  4.36,76.77 0 top
H2  61.2,76.77 0 top
H3  61.2,4.38 0 top
H4  4.36,4.38 0 top
IC1  28.81,21.51 270 top
IC2  28.81,46.93 270 top
J1  68.81,11.05 270 top
J2  68.81,23.75 270 top
J3  68.81,36.45 270 top
J4  68.81,49.15 270 top
J5  68.81,61.85 270 top
J6  68.81,75.82 270 top
J7  6.9,38.99 90 top
J8  7.22,63.75 90 top
J9  7.22,51.05 90 top
JP_LED1  40.24,20.25 0 bottom
JP_LED2  40.24,46.93 0 bottom
JP_LED3  40.24,63.44 0 bottom
K1_AB  42.78,20.25 0 top
K1_CD  42.78,46.93 0 top
K1_EF  42.78,63.44 0 top
K2_AB  42.78,20.25 0 top
K2_CD  42.78,46.93 0 top
K2_EF  42.78,63.44 0 top
K3_A  50.4,16.45 180 top
K3_C  50.4,43.12 180 top
K3_E  50.4,59.62 180 top
K4_B  50.4,24.06 180 top
K4_D  50.4,50.73 180 top
K4_F  50.4,67.25 180 top
K_RES_G  13.57,65.98 270 top
K_RES_H  13.57,52.01 270 top
LED1  62.15,12 270 top
LED2  62.47,27.24 90 top
LED3  62.47,37.4 270 top
LED4  62.47,52.64 90 top
LED5  62.47,57.4 270 top
LED6  62.47,67.88 90 top
LED7  3.41,11.37 90 top
LED8  35.48,68.83 0 top
LED9  35.48,58.36 0 top
LED10  36.43,53.91 0 top
LED11  36.43,39.94 0 top
LED12  36.75,27.88 0 top
LED13  36.75,12.63 0 top
MONO3  44.05,23.75 90 bottom
NO_OPTW1  22.78,78.67 0 bottom
NO_OPTW2  26.27,78.67 0 bottom
NWS1  73.58,74.87 90 bottom
NWS2  58.02,62.48 270 bottom
OPT_LED  44.05,76.14 180 top
OUT_A  71.67,10.1 270 top
OUT_B  71.67,22.79 270 top
OUT_C  71.67,35.5 270 top
OUT_D  71.67,48.2 270 top
OUT_E  71.67,60.9 270 top
OUT_F  71.67,74.87 270 top
OUT_G  3.73,64.7 90 top
OUT_H  3.73,52.01 90 top
R1  18.65,7.55 90 top
R2  18.65,25.33 90 top
R3  62.47,22.16 270 top
R4  65.64,17.4 90 top
R5  62.47,42.8 90 top
R6  62.47,47.56 270 top
R7  62.47,62.8 90 top
R8  65.32,72.33 90 top
R9  7.22,11.37 270 top
R10  31.03,65.98 180 top
R11  31.35,76.14 180 top
R12  41.51,69.78 0 top
R13  41.51,57.09 0 top
R14  41.51,53.28 0 top
R15  41.51,40.58 0 top
R16  41.83,26.61 0 top
R17  42.78,12.32 270 top
RES_G1  19.92,55.82 270 bottom
RES_G2  19.92,53.28 270 bottom
RES_H  44.05,67.25 270 bottom
RN1  22.46,21.52 90 top
RN2  22.46,46.93 90 top
SINGLE  13.57,38.04 180 bottom
SV3  14.68,78.93 0 top
SV4  14.68,1.84 0 top
TERM  30.08,78.67 180 bottom
U2R  14.9,15.33 270 top
U3H  14.71,15.36 0 bottom
U4R  14.84,32.96 270 top
U5H  14.84,32.96 0 bottom
U5R  23.73,62.16 0 top
U6H  23.41,62.16 270 bottom
U7R  23.73,72.33 0 top
U8H  23.73,72.33 270 bottom
WS1  58.02,64.7 270 bottom
WS2  55.16,67.25 270 bottom
WS3  50.72,62.16 270 bottom
WS4  12.3,64.7 90 bottom

### Tracks (layer width: path | path; a pad name or v marks a point on that pad's centre or on a via)
$N100
  Top 0.457: RN2.2 IC2.7 31.35,46.93 33.26,46.93 33.89,46.29 33.89,45.02 32.62,43.75 IC2.11
+5V  (via drill 0.35)
  Top 0.457: 39.29,16.45 K1_AB.2 | 39.29,16.45 LED13.A | 39.29,16.45 K2_AB.1 | 27.54,6.28 25,6.28 | RN1.1 22.46,8.83 | K1_CD.2 K2_CD.1 38.34,43.12 LED11.A | 31.35,29.14 34.21,29.14 LED12.A 34.21,26.61 v28.81,26.61 28.01,26.61 25.51,24.1 18.69,24.1 R2.1 | K3_E.9 53.26,57.09 55.48,59.31 55.48,59.94 54.21,61.21 54.21,62.8 52.94,64.07 K4_F.9 51.67,64.7 50.4,65.98 v50.4,71.06 | K1_EF.2 K2_EF.1 35.48,59.62 LED9.A | OPT_LED.1 47.86,78.67 45.95,78.67 44.69,77.41 OPT_LED.5 43.41,77.41 42.15,78.67 35.16,78.67 R11.1 | R10.1 32.3,66.93 LED8.A | 21.19,49.47 29.45,49.47 31.98,52.01 33.26,52.01 LED10.A
  Top 1.016: C2.1 19.03,41.46 19.03,40.84 21.46,38.42 22.08,38.42 RN2.1 22.46,35.43 21.98,34.95 21.98,33.5 23,32.47 28.02,32.47 v30.08,30.41 31.35,29.14
  Top 1.27: LED13.A 35.47,12.62 IC1.9 28.81,8.81 C1.1 27.54,6.28 27.13,5.88 25.58,5.88 25.17,6.28 25,6.28 22.46,8.83 21.19,8.83 R1.1 18.16,6.28 16.79,7.66 12.2,7.66 12.1,7.55 v11.03,7.55 v9.76,8.83 9.76,10.1 R9.1 | K_RES_H.2 11.13,54.44 11.13,51.21 12.87,49.47 v17.38,49.47 v18.65,49.47 21.19,49.47
  Bottom 0.457: 4.2,16.6 5.95,18.35 5.95,20.25 CON1.1 | 4.2,16.6 4.04,16.45 6=5V.2 | R9.1 4.36,15.49 4.36,16.45 4.2,16.6 | K2_AB.1 38.97,19.62 39.61,20.25 JP_LED1.2 | K2_CD.1 38.97,46.29 39.61,46.93 JP_LED2.2 | IC2.9 35.16,38.04 | LED12.A LED13.A | K3_A.9 54.21,15.18 54.21,20.25 K4_B.9 53.26,21.52 54.21,22.48 54.21,28.83 54.84,29.46 54.84,38.99 53.26,40.58 K3_C.9 54.21,41.84 54.21,46.93 54.05,47.08 | K4_D.9 54.05,47.08 | K3_E.9 53.58,56.45 53.58,54.55 54.21,53.91 54.21,47.24 54.05,47.08 | K2_EF.1 38.97,62.8 39.61,63.44 JP_LED3.2 | LED10.A 35.16,54.86 34.52,55.5 34.52,58.04 LED9.A LED8.A 34.21,74.55 R11.1 | v50.4,71.06 50.4,75.82 49.13,77.09 OPT_LED.1
  Bottom 1.27: LED10.A 35.16,50.48 34.95,50.27 34.95,49.3 35.16,49.09 LED11.A 35.16,38.04 35.69,37.5 35.69,33.95 35.48,33.74 LED12.A 35.48,27.41 35.1,27.03 35.1,20.47 35.48,20.09 LED13.A | v11.03,7.55 11.03,2 SV4.1 | CON1.1 6.17,13.68 R9.1 | v9.76,8.83 10.97,7.62 | SV3.1 10.87,73.27 9.35,71.75 9.35,68.52 | K_RES_H.2 9.35,56.22 9.35,68.52 | K_RES_G.2 9.35,68.52 | C2.1 v18.65,49.47 v17.38,49.47 | C1.1 v28.81,26.61 28.81,28.4 29.6,29.19 29.6,29.93 v30.08,30.41
  pour Top: 0.87,78.67 2.14,79.95 74.53,79.95 74.53,1.21 0.87,1.21
A_CO  (via drill 0.35)
  Top 0.457: 58.66,12.32 58.66,12.63
  Top 0.61: v45.32,11.37 57.38,11.37 58.66,12.63 60.19,14.17 60.19,27.21 60.56,27.57 v60.56,28.19 | OUT_A.2 71.51,8.51 J1.2 63.25,8.51 63.01,8.75 62.22,8.75 58.66,12.32 D5.A 51.11,4.77 39.42,4.77 38.26,3.61 38.26,2.83 36.87,1.45 33.45,1.45 32.42,2.48 D11.C
  Bottom 0.61: v45.32,11.37 K3_A.6 45.32,15.18 K1_AB.P1 45.32,17.71 K3_A.5 | ABC1.1 v60.56,28.19
A_NC  (via drill 0.35)
  Top 0.457: v57.07,56.13 58.34,57.4 58.97,57.4 v61.2,55.18
  Top 0.61: D11.A 24.68,3.43 30.11,3.43 30.71,4.02 31.99,4.02 32.59,3.43 D1.C
  Top 0.813: K3_A.1 52.94,16.45 K1_AB.O1
  Bottom 0.457: v57.07,56.13 57.07,55.82 54.84,55.82 54.21,56.45 54.21,57.72 53.58,58.36 53.58,59.94 54.21,60.58 54.21,62.8 53.89,63.12 53.89,63.44 51.67,63.44 49.77,65.34 ABC5.2 | v61.2,55.18 61.2,53.28 61.83,52.64 63.1,52.64
  Bottom 0.61: OUT_A.1 71.67,14.73 73.93,16.98 73.93,34.31 73.89,34.34 73.89,36.65 73.93,36.68 73.93,50.51 71.8,52.64 63.1,52.64 | D1.C 37.62,5.89 51.48,5.89 51.75,6.16 51.75,9.59 51.59,9.74 51.59,16.37 K1_AB.O1
  Bottom 0.813: OUT_A.1 70.88,11.05 J1.1 67.78,11.05 60.3,18.53 55.94,18.53 K3_A.1
A_NO
  Bottom 0.813: OUT_A.3 70.55,5.97 J1.3 66.26,8.52 66.26,11.21 61.02,16.45 K1_AB.S1 56.75,15.18 K3_A.10
B_CO  (via drill 0.35)
  Top 0.457: K4_B.6 44.05,21.52 | 38.81,26.76 41.03,28.99 41.19,28.83 41.51,28.83
  Top 0.61: OUT_B.2 71.51,21.21 J2.2 | v65.64,29.14 63.73,29.14 63.02,29.86 58.26,29.86 D10.A 56,30.73 54.02,28.75 47.67,28.75 47.6,28.83 41.51,28.83 | v34.52,34.54 36.43,34.54 38.26,32.71 40.43,32.71 41.59,31.55 41.59,29.54 41.03,28.99 | 38.81,26.76 38.81,26.39 37.75,25.33 37.75,22.8 38.47,22.08 40.63,22.08 v41.19,21.52 44.05,21.52 | 44.05,21.52 K2_AB.P2 45.32,25.33 K4_B.5 | K4_B.6 44.05,21.52
  Bottom 0.457: v41.19,21.52 41.19,20.57 40.88,20.25 JP_LED1.1
  Bottom 0.61: ABC2.1 63.1,29.78 63.42,29.46 65.32,29.46 v65.64,29.14 65.64,24.38 J2.2 | D12.C 31.67,34.54 v34.52,34.54
B_NC  (via drill 0.35)
  Top 0.457: 23.73,35.81 23.73,38.99 23.41,39.3 21.83,39.3 19.92,41.21 19.92,43.12 9.76,43.12 8.04,41.4 8.04,39.78 6.9,38.64 J7.2
  Top 0.61: J2.1 65.96,20.89 R3.2 | K4_B.1 52.94,24.06 K2_AB.O2 v49.45,26.29 | D6.C v34.52,35.81 | v30.4,35.81 23.73,35.81 D12.A
  Bottom 0.61: OUT_B.1 70.88,23.75 J2.1 | R3.2 56.75,26.61 K4_B.1 | D6.C 39.92,35.81 42.39,33.35 45.76,33.35 46.03,33.08 46.03,29.7 v49.45,26.29 | v34.52,35.81 v30.4,35.81 | ABC.2 4.26,37.72 J7.2
B_NO
  Top 0.61: J2.3 R4.2
  Bottom 0.61: OUT_B.3 70.55,18.67 J2.3 | R4.2 62.15,18.67 K2_AB.S2 56.75,22.79 K4_B.10
C_CO  (via drill 0.35)
  Top 0.61: v64.37,30.73 61.75,33.35 53.24,33.35 50.96,35.63 50.96,37.04 50.21,37.79 49.69,37.79 v49.45,38.04
  Bottom 0.457: 46.11,41.37 46.27,41.53 | 64.37,32.32 63.1,32.32 ABC2.2
  Bottom 0.61: OUT_C.2 68.98,33.75 J3.2 67.23,32.32 64.37,32.32 v64.37,30.73 | v49.45,38.04 46.11,41.37 K3_C.6 | 46.27,41.53 46.59,41.84 K1_CD.P1 45.32,44.39 K3_C.5
C_NC
  Top 0.61: K1_CD.O1 52.94,43.12 K3_C.1 56.04,45.1 57.26,45.1 57.97,44.38 57.97,44.01 61.97,40.02 63.02,40.02 66.59,36.45 J3.1
  Bottom 0.61: OUT_C.1 70.88,36.45 J3.1 | K1_CD.O1 50.08,44.7 ABC3.2
C_NO
  Top 0.61: K3_C.10 58.26,37.79 59.1,37.79 59.37,37.53 59.37,37.33 65.32,31.37 J3.3
  Bottom 0.61: OUT_C.3 70.55,31.37 J3.3 | K3_C.10 55.48,41.84 K1_CD.S1
D_CO  (via drill 0.35)
  Top 0.457: 63.1,52.64 61.83,52.64
  Top 0.61: J4.2 63.81,51.61 63.81,51.93 63.1,52.64 | 61.83,52.64 58.41,52.64 56.43,54.62 47.71,54.62 46.36,53.28 K4_D.5 | K4_D.6 45,47.88 v41.83,47.88
  Bottom 0.457: v41.83,47.88 40.88,46.93 JP_LED2.1 | 61.51,37.08 61.83,37.4 63.1,37.4
  Bottom 0.61: OUT_D.2 68.98,46.45 J4.2 68.81,46.04 67.42,44.65 67.42,41.72 63.1,37.4 | ABC1.2 60.56,36.13 61.51,37.08 | K4_D.5 46.59,52.01 K2_CD.P2 46.59,49.47 K4_D.6
D_NC
  Top 0.457: 52.3,50.73 K2_CD.O2
  Top 0.61: R6.2 57.97,50.79 57.97,52 57.26,52.72 56.04,52.72 K4_D.1 54.84,53.28 52.3,50.73
  Bottom 0.61: OUT_D.1 70.88,49.15 J4.1 65.96,46.29 R6.2 | K2_CD.O2 51.55,50.85 51.55,53.62 50.4,54.77 ABC4.2
D_NO
  Top 0.61: J4.3 R5.2 62.06,44.07 58.52,47.61 56.06,47.61 K4_D.10 55.48,49.47 K2_CD.S2
  Bottom 0.61: OUT_D.3 70.55,44.07 J4.3
E_CO  (via drill 0.35)
  Top 0.457: 7.22,18.35 2.46,13.59 2.14,13.27 2.14,9.46 2.77,8.83 6.58,8.83 10.71,4.7 17.38,4.7 17.88,5.19 19.1,5.19 20.69,6.78 | v65.32,9.46 71.99,16.13
  Top 0.61: v64.69,59.31 J5.2 71.51,59.31 OUT_E.2 71.67,58.46 73.93,56.21 73.93,16.98 73.13,16.19 72.05,16.19 71.99,16.13 68.31,12.44 68.24,12.44 67.42,11.63 67.42,11.55 v65.32,9.46 | v62.78,70.74 61.65,70.74 60.65,71.74 51.95,71.74 51,72.69 48.13,72.69 v47.86,72.96 | v30.08,4.7 22.78,4.7 20.69,6.78 | 17.38,4.7 17.34,4.74 10.57,4.74 6.55,8.75 2.85,8.75 2.06,9.54 2.06,13.19 2.46,13.59 | 2.14,13.27 7.22,18.35 v8.17,18.35
  Bottom 0.61: v64.69,59.31 64.61,59.38 64.61,68.91 v62.78,70.74 | v47.86,72.96 47.86,67.26 47.81,67.21 47.81,64.32 46.24,62.75 45.9,62.75 K3_E.5 45.32,60.9 K1_EF.P1 45.32,58.36 K3_E.6 | v8.17,18.35 8.17,18.65 8.22,18.7 8.22,33.52 8.12,33.62 8.12,39.04 J7.3 4.28,40.26 ABC.3 | v30.08,4.7 30.75,4.02 31.99,4.02 32.9,3.12 32.9,1.99 33.45,1.45 36.43,1.45 36.87,1.45 38.26,2.83 38.26,3.61 39.42,4.77 55.41,4.77 59.38,8.75 64.61,8.75 v65.32,9.46
E_NC  (via drill 0.35)
  Top 0.61: K3_E.1 59.82,62.16 61.88,60.11 63.1,60.11 63.13,60.14 64.89,60.14 66.59,61.85 J5.1 | v54.53,59.62 K1_EF.O1
  Bottom 0.457: WS1.2 NWS2.1 58.02,62.8 55.48,62.8 K3_E.1
  Bottom 0.61: OUT_E.1 70.88,61.85 J5.1 | K3_E.1 55.48,60.58 v54.53,59.62 | K1_EF.O1 50.72,60.58 WS3.2
E_NO  (via drill 0.35)
  Top 0.457: v54.21,65.66 54.21,64.07 54.84,63.44 56.36,63.44 56.43,63.36 | J5.3 68.18,57.4 61.83,57.4 61.56,57.67 v61.46,57.67 60.03,59.1 59.96,59.17 59.59,59.54 59.59,59.62
  Top 0.61: 59.59,59.62 K1_EF.S1 | v61.2,62.48 60.58,62.48 59.7,63.36 56.43,63.36
  Bottom 0.457: 54.37,65.82 v54.21,65.66 | 63.1,57.4 61.83,57.4 61.56,57.67 v61.46,57.67 60.93,58.2
  Bottom 0.61: OUT_E.3 70.55,56.77 J5.3 68.18,57.4 63.1,57.4 | v61.2,62.48 61.2,62.27 60.93,62.01 60.93,58.2 | WS2.2 55.16,66.61 54.37,65.82 | K3_E.10 55.48,58.36 K1_EF.S1
F_CO  (via drill 0.35)
  Top 0.457: 64.05,67.88 v60.56,67.88 | 46.91,73.28 v46.59,72.96 | v33.89,78.67 20.55,78.67 15.16,73.28 8.29,73.28 v6.01,70.99 | v9.76,41.84 8.65,40.74 8.65,39.47 8.04,38.86 8.04,37.24 6.9,36.1 J7.1
  Top 0.61: OUT_F.2 68.98,73.12 J6.2 66.74,71.21 66.74,70.47 64.16,67.88 64.05,67.88 | v54.84,73.59 49.76,73.59 49.69,73.52 48.48,73.52 48.21,73.8 47.43,73.8 46.91,73.28 | K4_F.6 45,64.39 v41.83,64.39
  Bottom 0.356: 5.92,55.82 5.92,55.63 6.69,54.86 7.75,54.86 9.76,52.85 9.76,52.01
  Bottom 0.406: v6.01,70.99 6.01,69.45 5.92,69.37 5.92,63.22 5.95,63.19 5.95,56.69 5.92,56.67 5.92,55.82
  Bottom 0.457: 9.76,52.01 v9.76,41.84 | v33.89,78.67 45.32,78.67 45.32,76.77 45.95,76.14 47.86,76.14 47.86,74.23 v46.59,72.96
  Bottom 0.61: NWS1.1 73.58,73.59 73.1,73.12 OUT_F.2 | v60.56,67.88 v54.84,73.59 | v46.59,72.96 46.59,71.06 K4_F.5 45.32,68.52 K2_EF.P2 45.32,65.98 K4_F.6 | JP_LED3.1 41.51,63.44 41.83,63.75 v41.83,64.39 | ABC.1 5.22,35.18 J7.1
F_NC  (via drill 0.35)
  Top 0.61: J6.1 66.59,73.59 R8.2 | v60.56,69.78 K4_F.1
  Bottom 0.457: K4_F.1 55.48,68.83
  Bottom 0.61: J6.1 70.88,75.82 OUT_F.1 73.1,76.62 73.42,76.29 73.58,76.14 NWS1.2 | R8.2 63.3,71.57 62.44,71.57 60.65,69.78 v60.56,69.78 | WS2.1 55.16,68.52 55.48,68.83 53.89,68.83 53.5,68.44 52.86,68.44 K2_EF.O2 51.35,67.56 50.08,67.56 49.77,67.25 ABC5.1
F_NO
  Top 0.457: 62.15,64.07 56.12,64.07 K4_F.10 | 62.15,64.07 J6.3 | 62.15,64.07 R7.2
  Top 0.61: J6.3 62.47,64.39 R7.2 60.58,64.07 60.53,64.12 56.06,64.12 K4_F.10
  Bottom 0.61: OUT_F.3 70.55,70.74 J6.3 | K4_F.10 55.48,65.51 56.26,66.29 56.26,66.75 K2_EF.S2 58.02,65.98 WS1.1
GND  (via drill 0.35)
  Top 0.457: LED1.K 62.15,11.37 60.88,12.63 60.88,26.92 LED2.K | LED5.K LED4.K | C3R1.2 32.94,71.06 33.89,72.01 50.72,72.01 51.67,71.06 60.36,71.06 62.27,69.15 LED6.K | LED3.K 61.83,36.13 v60.24,37.72 | LED7.K 5.31,12.63 6.9,14.22 8.49,14.22 8.65,14.06 8.81,14.22
  Top 1.27: C2.2 14.74,40.47 12.54,40.47 9.48,37.41 9.48,31.04 11.03,29.49 U4R.4 8.24,26.35 7.75,26.35 6.74,25.33 CON1.5 | U2R.4 8.65,13.97 8.65,14.06 | 8.81,14.22 9.34,14.75 9.34,21.95 8.49,22.79 CON1.3
  Bottom 0.457: LED3.K 61.83,35.5 61.83,29.14 LED2.K | LED6.K 61.51,68.2 61.51,67.56 60.24,66.29 60.24,57.4 60.4,57.24 | 60.4,57.24 62.47,55.18 LED4.K | 27.38,59.15 27.54,58.99 U5R.4 28.18,57.72 28.18,33.59 | 27.38,59.15 26.27,60.26 U6H.4 | 27.38,59.15 27.54,59.31 29.76,59.31 C3H.2 29.76,60.9 C3R.2 33.57,62.16 33.57,66.29 30.08,69.78 | 27.38,69.63 27.54,69.47 U7R.4 | 27.38,69.63 26.59,70.42 U8H.4 | C3R1.2 30.08,71.06 C3H1.2 30.08,69.78 | 30.08,69.78 27.54,69.78 27.38,69.63 | v60.24,37.72 60.24,57.09 60.4,57.24 | IC2.8 26.27,36.77 | U3H.4 12.62,12.63 11.35,11.37 U2R.4 | C1R.2 13.57,6.28 13.57,8.83 C1H.2 13.25,9.14 | U5H.4 12.94,30.1 11.03,30.1 U4R.4 13.25,26.92 13.25,26.61 C2H.2 13.57,26.61 C2R.2 | 26.63,12.63 26.61,12.62 IC1.8
  Bottom 0.508: 26.63,28.23 25.7,29.16 21.18,29.16 20.81,29.53 | 26.27,36.77 26.27,34.23 26.91,33.59 28.18,33.59
  Bottom 1.016: 18.37,38.31 18.5,38.19 19.24,38.19 20.07,37.35 20.07,33.14 20.68,32.53 20.68,29.65 20.81,29.53
  Bottom 1.27: SV3.3 15.95,73.27 14.43,71.75 14.43,43.52 C2.2 16.11,40.58 18.37,38.31 | 28.18,33.59 28.18,29.78 26.63,28.23 26.63,12.63 26.63,7.91 C1.2 25.05,7.55 21.18,3.68 17.79,3.68 SV4.3 13.58,4.21 C1R.2 13.25,6.35 13.25,9.14 13.25,9.37 U2R.4 | CON1.5 CON1.3
  pour Bottom: 0.87,79.95 74.53,79.95 74.53,1.21 0.87,1.21
IB1
  Top 0.457: IC1.6 RN1.3 21.19,16.45 21.19,12.32 18.97,10.1 18.33,10.1 14.52,13.91 11.35,13.91 U2R.3
  Bottom 0.457: U3H.3 13.89,12.95 13.57,13.27 13.57,13.91 13.25,14.22 11.35,14.22 U2R.3
IB2  (via drill 0.35)
  Top 0.457: IC2.6 RN2.3 21.83,43.75 9.12,43.75 v8.81,43.43
  Bottom 0.457: U5H.3 14.21,30.41 13.89,30.73 13.89,31.05 13.25,31.68 U4R.3 8.81,33.91 v8.81,43.43
IB3  (via drill 0.35)
  Top 0.457: v35.48,57.4 35.16,57.4 34.84,57.09 26.27,57.09 U5R.3
  Bottom 0.457: U6H.3 24.68,61.53 24.68,58.67 U5R.3 | OPT_LED.4 45.32,73.59 37.38,73.59 37.38,73.91 36.75,74.55 35.48,74.55 v35.48,57.4
IB4
  Top 0.457: OPT_LED.8 38.97,74.87 36.75,72.64 33.57,72.64 33.26,72.33 28.81,72.33 U7R.3
  Bottom 0.457: U8H.3 25,71.69 U7R.3
IG1  (via drill 0.35)
  Top 0.457: IC1.4 RN1.5 19.95,20.29 15.7,20.29 15.04,19.62 v12.62,19.62
  Bottom 0.457: U3H.2 15.16,12.95 14.84,13.27 14.84,13.91 12.3,16.45 11.35,16.45 U2R.2 11.03,16.76 9.76,18.03 9.76,20.57 11.66,20.57 v12.62,19.62
IG2  (via drill 0.35)
  Top 0.457: IC2.4 RN2.5 19.29,48.2 16.43,45.34 v10.71,45.34
  Bottom 0.457: U5H.2 15.47,30.41 15.16,30.73 15.16,31.05 11.98,34.23 U4R.2 9.76,35.5 9.76,37.4 10.71,38.35 v10.71,45.34
IG3  (via drill 0.35)
  Top 0.457: U5R.2 25,60.9 v27.54,60.9 v30.4,58.04 | v55.8,38.99 38.65,38.99 36.43,36.77 v33.57,36.77
  Bottom 0.457: U6H.2 27.54,62.8 v27.54,60.9 | OPT_LED.3 47.86,78.67 50.4,78.67 50.4,76.77 59.61,67.56 59.61,56.13 58.97,55.5 57.7,55.5 57.7,52.32 58.02,52.01 58.02,41.21 v55.8,38.99 | v33.57,36.77 30.4,36.77 v30.4,58.04
IG4
  Top 0.457: OPT_LED.7 35.48,77.41 32.94,74.87 31.35,74.87 29.45,72.96 26.91,72.96 U7R.2
  Bottom 0.457: U8H.2 23.73,72.96 23.73,69.78 U7R.2
IR1  (via drill 0.35)
  Top 0.457: RN1.7 IC1.2 | v16.11,14.22 11.35,18.98 U2R.1
  Bottom 0.457: v16.11,14.22 16.11,13.27 16.43,12.95 U3H.1 16.43,12.63 16.43,12 14.84,10.41 14.84,4.7 20.75,4.7 21.35,5.3 21.35,9.88 21.17,10.07 21.17,20.68 22.06,21.58 22.96,21.58 23.73,22.34 23.73,26.29 25,27.56 IC1.2
IR2  (via drill 0.35)
  Top 0.457: IC2.2 RN2.7 20.87,51.69 v12.3,51.69 | U4R.1 12.94,34.86 | 12.94,34.86 v13.57,34.23 | 12.94,34.86 v15.16,37.08
  Bottom 0.457: RN2.7 22.46,52.96 19.92,52.96 RES_G2.2 | v13.57,34.23 16.43,31.37 16.43,30.73 16.75,30.41 U5H.1 | v12.3,51.69 12.3,48.31 12.91,47.7 12.91,41.03 14.74,39.2 14.95,38.99 15.16,38.78 v15.16,37.08
IR3
  Top 0.457: RN1.8 IC1.1
  Bottom 0.457: RES_G1.2 RES_G2.1 19.92,53.59 18.65,53.59 18.65,52.01 21.24,49.41 21.24,42.61 22.06,41.79 22.96,41.79 23.78,40.98 23.78,36.26 25.2,34.84 25.2,33.62 25,33.41 IC1.1
IR4  (via drill 0.35)
  Top 0.457: v24.68,74.23 19.92,69.47 U7R.1 | v32.62,77.72 31.35,76.45 31.35,75.82 30.08,74.55 v27.86,74.55
  Bottom 0.457: v24.68,74.23 U8H.1 26.59,74.23 26.59,74.55 v27.86,74.55 | OPT_LED.6 42.78,76.14 33.89,76.14 33.89,76.45 v32.62,77.72
N$1  (via drill 0.35)
  Top 0.457: v16.43,16.45 18.65,14.22 U2R.6
  Bottom 0.457: 9.12,16.13 9.12,21.21 12.3,21.21 13.57,19.94 13.57,18.35 13.89,18.03 U3H.6 14.21,17.71 14.21,16.45 v16.43,16.45 | 9.12,16.13 7.22,18.03 7.22,18.67 7.54,18.98 7.54,21.52 5,21.52 3.73,20.25 CON1.2 | 9.12,16.13 9.95,15.3 9.95,11.05 12.24,8.76 12.24,3.02 SV4.2
N$2
  Top 0.457: R3.1 LED2.A
N$3  (via drill 0.35)
  Top 0.457: U7R.5 27.54,75.82 v22.78,71.06 21.19,69.47 21.19,67.88 20.55,67.25 19.29,67.25 18.02,68.52 v18.02,71.06 | v17.38,25.02 17.06,25.02 16.75,25.33 8.17,25.33 6.9,24.06 5,24.06 3.73,22.79 CON1.4 3.73,23.11 v2.14,24.7 | v7.86,73.91 12.62,73.91 17.38,78.67 18.33,78.67 SV3.4 | v20.59,5.61 20.52,5.61 18.49,3.59 SV4.4
  Bottom 0.457: TERM.1 27.54,78.67 | 27.54,78.67 NO_OPTW2.1 | U8H.5 22.78,70.42 v22.78,71.06 | U7R.5 27.54,78.67 | v18.02,71.06 18.02,78.36 18.33,78.67 SV3.4 | v17.38,25.02 17.38,23.75 20.55,20.57 20.53,20.55 20.53,9.84 20.59,9.78 v20.59,5.61 | v7.86,73.91 5.31,71.37 1.5,71.37 1.5,25.33 v2.14,24.7
N$4  (via drill 0.35)
  Top 0.457: v15.79,19.3 18.65,19.3 U2R.8
  Bottom 0.457: v15.79,19.3 16.11,18.98 16.11,18.35 16.43,18.03 U3H.8 | C1R.1 16.11,6.28 16.11,8.83 C1H.1 16.43,8.83 R1.2 19.92,10.1 19.92,18.03 18.97,18.98 U2R.8
N$5
  Top 0.457: LED1.A 62.78,13.27 R4.1
N$6
  Bottom 0.457: 6=5V.1 2.77,16.45 2.14,17.08 2.14,23.43 3.41,24.7 3.41,25.33 CON1.6
N$7
  Top 0.457: IC1.7 RN1.2 | IC1.7 27.22,17.4 32.62,17.4 IC1.11 | IC1.7
N$8
  Top 0.457: R6.1 LED4.A
N$9
  Top 0.457: IC1.3 RN1.6 | IC1.3 27.22,27.56 32.62,27.56 IC1.15 | IC1.3
N$10  (via drill 0.35)
  Top 0.457: v28.49,77.09 28.18,77.41 24.37,77.41 23.73,76.77 23.73,75.5 21.19,72.96 15.79,72.96 15.16,72.33 v12.94,72.33
  Bottom 0.457: v28.49,77.09 28.49,77.41 30.08,77.41 30.4,77.72 30.4,78.67 TERM.2 | v12.94,72.33 13.57,72.96 13.57,78.67 SV3.2
N$11
  Top 0.457: IC1.5 RN1.4 | IC1.5 27.22,22.48 32.62,22.48 IC1.13 | IC1.5
N$12
  Bottom 0.457: R5.1 LED3.A
N$13
  Bottom 0.457: U4R.8 18.65,35.81 18.21,35.37 17.51,35.37 | C2R.1 16.11,26.61 C2H.1 R2.2 18.65,27.53 17.51,28.67 17.51,29.62 18.43,30.54 19.12,30.54 19.79,31.21 19.79,32.16 18.87,33.08 18.18,33.08 17.51,33.75 17.51,35.37 | U5H.8 17.32,35.55 17.51,35.37
N$14
  Bottom 0.457: R8.1 65.64,70.74 65.64,59.19 65,58.55 64.37,58.55 63.93,58.99 63.93,65.15 LED6.A
N$15
  Bottom 0.457: R7.1 LED5.A
N$16
  Top 0.61: D1.A 39.61,8.51 D2.C
N$17  (via drill 0.35)
  Top 0.457: v27.22,34.86 31.67,30.41 IC1.16 | IC2.1 RN2.8
  Bottom 0.457: v27.22,34.86 26.91,35.18 26.91,53.91 IC2.1
N$18
  Top 0.457: RN2.4 IC2.5 27.54,48.2 IC2.13
N$19
  Top 0.61: D2.A D3.C
N$20  (via drill 0.35)
  Top 0.457: v14.84,27.88 U4R.6
  Bottom 0.457: SINGLE.2 14.21,38.04 U5H.6 14.21,35.5 14.52,35.18 14.52,34.86 17.7,31.68 U4R.6 | 17.38,15.18 14.52,15.18 13.25,16.45 13.25,17.4 12.94,17.71 U3H.5 | 17.38,15.18 17.38,12.95 18.65,11.68 U2R.5 | v14.84,27.88 14.84,21.52 17.38,18.98 17.38,15.18
N$21
  Top 0.61: D4.C D3.A
N$22
  Top 0.457: R9.2 LED7.A
N$23
  Top 0.61: D4.A D5.C
N$24
  Bottom 0.61: D7.A 47.86,36.45 D8.C
N$25
  Top 0.61: D9.C 52.3,30.73 D8.A
N$26
  Top 0.61: D10.C 53.58,35.81 D9.A
N$27
  Bottom 0.61: D7.C 43.41,30.73 D6.A
N$28  (via drill 0.35)
  Top 0.457: v46.91,64.7 v48.81,64.7 | v43.73,62.48 36.11,62.48 33.26,59.62 30.08,59.62 27.86,61.85 23.41,61.85 U5R.1
  Bottom 0.457: 19.92,57.72 RES_G1.1 | U6H.1 24.05,64.07 24.05,61.85 19.92,57.72 | 19.92,57.72 U5R.1 | OPT_LED.2 48.81,74.55 48.81,67.25 48.5,66.93 48.5,65.02 v48.81,64.7 | v46.91,64.7 46.59,64.39 46.59,64.07 45.95,63.44 43.73,63.44 v43.73,62.48
N$29
  Top 0.457: RN2.6 IC2.3 27.54,53.28 IC2.15
N$30  (via drill 0.35)
  Top 0.457: OUT_G.2 3.73,66.29 J8.2 v10.71,66.29 | K_RES_G.5 K_RES_G.6
  Bottom 0.457: K_RES_G.5 11.03,65.98 v10.71,66.29 11.98,66.29 12.3,65.98 WS4.2
N$31  (via drill 0.35)
  Top 0.457: IC2.16 27.22,55.82 25.95,54.55 v18.97,54.55
  Bottom 0.457: v18.97,54.55 17.38,56.13 17.38,63.44 16.11,64.7 K_RES_G.9
N$32  (via drill 0.35)
  Top 0.457: v48.81,62.8 46.59,62.8 45.95,63.44 v37.38,63.44 | v37.07,65.66 33.57,65.66 32.62,64.7 26.59,64.7 25,63.12 12.62,63.12 12.14,63.59 | 12.14,63.59 11.98,63.75 J8.1 4.52,63.75 OUT_G.1 | K_RES_G.1 11.03,70.42 12.3,69.15 12.3,63.75 12.14,63.59
  Bottom 0.457: v37.38,63.44 37.07,63.75 v37.07,65.66
  Bottom 0.61: WS3.1 50.72,63.42 50.71,63.43 49.44,63.43 v48.81,62.8
N$33
  Top 0.457: K_RES_G.10 12.94,71.06 11.66,72.33 10.39,72.33 7.7,69.63 | 7.7,69.63 7.22,69.15 J8.3 | OUT_G.3 3.73,69.78 7.54,69.78 7.7,69.63
N$34  (via drill 0.35)
  Top 0.457: U5R.5 26.91,65.98 25,64.07 v18.02,64.07
  Bottom 0.457: NO_OPTW2.2 25,78.67 | 25,78.67 NO_OPTW1.1 | 25,78.67 U7R.6 22.46,73.59 22.46,72.64 21.51,71.69 U8H.6 19.92,71.69 18.02,69.78 v18.02,64.07 18.02,60.26 U6H.5
N$35
  Bottom 0.457: U6H.8 20.55,64.07 19.92,64.7 U5R.8 21.19,67.25 29.76,67.25 R10.2 C3H.1 29.76,63.44 C3R.1
N$36  (via drill 0.35)
  Top 0.457: J9.2 3.73,53.59 OUT_H.2 | K_RES_H.6 11.66,46.93 | 11.66,46.93 v8.81,49.78 | 11.66,46.93 K_RES_H.5
  Bottom 0.457: J9.2 8.81,52.01 v8.81,49.78
N$37  (via drill 0.35)
  Top 0.457: v13.25,39.3 14.21,39.3 18.02,35.5 19.29,35.5 19.92,34.86 19.92,30.41 U4R.5 | v18.97,69.47 v18.97,72.01 | v12.62,58.67 16.43,58.67 v19.29,61.53
  Bottom 0.457: U5H.5 12.94,38.04 SINGLE.1 13.25,38.04 v13.25,39.3 12.3,40.26 12.3,47.45 11.03,48.72 11.03,53.28 11.56,53.28 12.62,54.34 v12.62,58.67 | NO_OPTW1.2 19.92,78.67 19.92,78.04 18.65,76.77 18.65,72.33 v18.97,72.01 | v18.97,69.47 18.65,69.15 18.65,64.7 19.6,63.75 19.6,62.16 19.76,62.01 | 19.76,62.01 20.24,61.53 U6H.6 21.19,61.53 22.14,62.48 22.14,63.12 U5R.6 | 19.76,62.01 v19.29,61.53
N$38
  Top 0.457: K_RES_H.10 12.94,57.09 11.66,58.36 9.44,58.36 8.01,56.93 | J9.3 8.01,56.93 | OUT_H.3 3.73,57.09 7.86,57.09 8.01,56.93
N$39
  Top 0.457: U7R.8 20.55,76.14 22.46,78.04 28.81,78.04 30.08,76.77 R11.2
  Bottom 0.457: U7R.8 19.92,75.18 20.87,74.23 U8H.8 | R11.2 C3H1.1 30.08,73.59 C3R1.1
N$40
  Top 0.457: K_RES_H.1 11.03,56.45 8.81,54.23 8.81,52.64 J9.1
  Bottom 0.457: J9.1 7.22,50.42 3.73,50.42 OUT_H.1
N$41  (via drill 0.35)
  Top 0.457: v43.1,65.66 42.46,65.66 42.15,65.34 38.02,65.34 34.84,62.16 28.49,62.16 28.18,62.48 22.14,62.48 17.38,57.72 17.38,55.82 K_RES_H.9
  Bottom 0.457: v43.1,65.66 44.05,66.61 RES_H.2
N$42
  Top 0.457: LED8.K 38.02,68.83 38.97,69.78 R12.1
N$43
  Top 0.457: LED9.K 37.7,58.36 38.97,57.09 R13.1
N$44
  Bottom 0.457: LED10.K 40.24,53.91 R14.1
N$45
  Bottom 0.457: LED11.K 40.24,39.94 R15.1
N$46
  Bottom 0.457: LED12.K 40.56,27.88 R16.1
N$47
  Top 0.457: LED13.K 41.83,12.63 R17.1
N$49  (via drill 0.35)
  Top 0.457: 56.43,46.61 56.12,46.93 52.3,46.93 51.99,47.24
  Top 0.508: 21.19,44.44 21.92,44.44 21.94,44.41 23.39,44.41 v23.73,44.07
  Top 0.61: v47.86,53.59 v50.08,51.37 50.45,51 50.45,48.78 51.99,47.24 | v58.66,54.55 v58.66,56.45 | v58.97,45.97 57.07,45.97 56.43,46.61 | 21.19,44.44 8.63,44.44 8.44,44.25 ABC.4 3.79,47.37 1.47,49.69 1.47,57.82 5.89,62.24 11.74,62.24 v11.98,62.48 | v25.95,39.3 28.81,39.3 v29.45,38.67
  Bottom 0.457: v47.86,53.59 49.13,54.86 49.13,57.09 49.45,57.4 50.4,57.4 ABC4.1 | v58.66,56.45 58.66,61.21 58.02,61.85 NWS2.2 | v25.95,39.3 26.27,39.62 26.27,44.39 24.05,44.39 v23.73,44.07 | WS4.1 12.3,62.8 v11.98,62.48
  Bottom 0.61: ABC3.1 50.08,48.2 | 50.08,48.2 v50.08,51.37 | v58.97,45.97 58.97,54.23 v58.66,54.55 | ABC.4 5.24,42.8 J7.4 | v29.45,38.67 29.56,38.55 29.56,33.82 31.17,32.21 31.17,19.46 30.66,18.95 30.66,10.2 34.34,6.53 35.98,6.53 38.26,8.8 38.26,9.59 38.53,9.85 41.95,9.85 42.18,9.62 44.27,9.62 44.5,9.85 47.94,9.85 50.28,12.2 50.28,25.94 50.48,26.13 50.48,38.19 48.81,39.85 48.81,46.93 50.08,48.2
OB1
  Top 0.457: 40.88,48.83 K2_CD.16 | 40.88,48.83 42.15,48.83 42.78,49.47 R14.2 | K3_C.2 47.23,45.66 45.95,46.93 41.51,46.93 40.88,47.56 40.88,48.83
  Bottom 0.457: K2_CD.16 36.43,48.2 36.43,39.3 37.7,38.04 37.7,29.35 36.75,28.4 36.75,27.24 36.11,26.61 36.11,20.89 36.75,20.25 36.75,11.37 34.84,11.37 34.21,12 34.21,13.27 32.62,14.86 IC1.10
OB2  (via drill 0.35)
  Top 0.457: IC2.10 32.62,41.21 36.11,44.7 v36.11,49.78 | v51.35,74.55 49.77,76.14 38.97,76.14 v36.43,73.59 | v36.43,70.42 35.48,69.47 35.48,67.56 v36.43,66.61
  Bottom 0.457: K1_EF.15 41.51,67.56 44.05,67.56 RES_H.1 | v36.11,49.78 36.43,50.1 36.43,54.55 37.38,55.5 42.78,55.5 R13.2 42.78,64.7 42.15,65.34 42.15,66.61 K1_EF.15 | K4_F.2 51.35,71.37 v51.35,74.55 | v36.43,70.42 v36.43,73.59 | v36.43,66.61 36.11,66.29 36.11,63.44 37.07,62.48 38.34,62.48 38.34,63.75 41.51,66.93 K1_EF.15
OG1
  Top 0.457: K4_B.2 53.58,26.61 54.84,27.88 56.12,27.88 58.02,25.97 58.02,14.54 56.12,12.63 44.37,12.63 R17.2
  Bottom 0.406: MONO3.2 44.05,25.02 42.84,25.02 41.76,23.94
  Bottom 0.457: 42.15,23.75 41.51,23.75 K1_AB.15 41.76,23.94 42.15,23.75 | 40.24,10.73 42.78,10.73 R17.2 | 40.24,10.73 32.62,10.73 31.35,12 31.35,18.67 32.62,19.94 IC1.12 | 42.15,23.75 42.15,19.62 40.24,17.71 40.24,10.73
OG2  (via drill 0.35)
  Top 0.457: 52.15,62.96 47.86,67.25 47.86,69.15 45.95,71.06 44.05,71.06 R12.2 | 52.15,62.96 K3_E.2 | v43.1,20.57 38.97,20.57 36.75,22.79 36.75,31.05 31.35,36.45 31.35,44.39 IC2.12 | 52.15,62.96 47.86,58.67 47.86,57.72 45.32,55.18 34.21,55.18 v33.89,54.86
  Bottom 0.406: MONO3.1 44.05,22.79 43.1,21.84 43.1,21.52
  Bottom 0.457: K1_EF.16 38.65,67.56 38.65,70.1 39.92,71.37 42.78,71.37 R12.2 | v43.1,20.57 43.1,21.52 | v33.89,54.86 33.89,46.93 IC2.12
OR1  (via drill 0.35)
  Top 0.457: IC1.14 32.62,25.02 36.43,21.21 v37.07,21.21 38.65,19.62 44.05,19.62 44.69,20.25 51.99,20.25 52.15,20.41 | K3_A.2 52.94,19.62 52.15,20.41 | 52.15,20.41 47.86,24.7 47.86,25.97 45.95,27.88 44.37,27.88 R16.2
  Bottom 0.457: K1_AB.16 37.07,22.16 v37.07,21.21
OR2  (via drill 0.35)
  Top 0.457: IC2.14 36.43,50.73 42.78,44.39 R15.2 | v50.72,53.28 K4_D.2
  Bottom 0.457: K1_CD.15 42.78,49.47 42.78,46.93 | R15.2 42.78,46.93 | v50.72,53.28 47.86,50.42 47.86,48.83 45.95,46.93 42.78,46.93

### Text on the board
Top: Top
Bottom: Bot
tNames: WS2811 Relais | NC | Ver.: 1.0 | 12.05.20 | NO | + | NO | + | NC | NC | + | NO | + | + | NO | NC | + | NC | WS2811 | Relais | Com | NO | Halt | + | NC | + | VA | NO | NC | + | + | NO | + | + | NC | + | NO | by Hardi
bNames: => | <= | +5V | GND | wiki.mobaledlib.de | V 1.0 | 12.05.20 | by Hardi | WS2811 Relais | MobaLedLib@gmx.de | <= | +5V | => | GND